# Altium schematic sheet usb ethernet.SchDoc
size A4; SheetNumber: 9; SheetTotal: 9
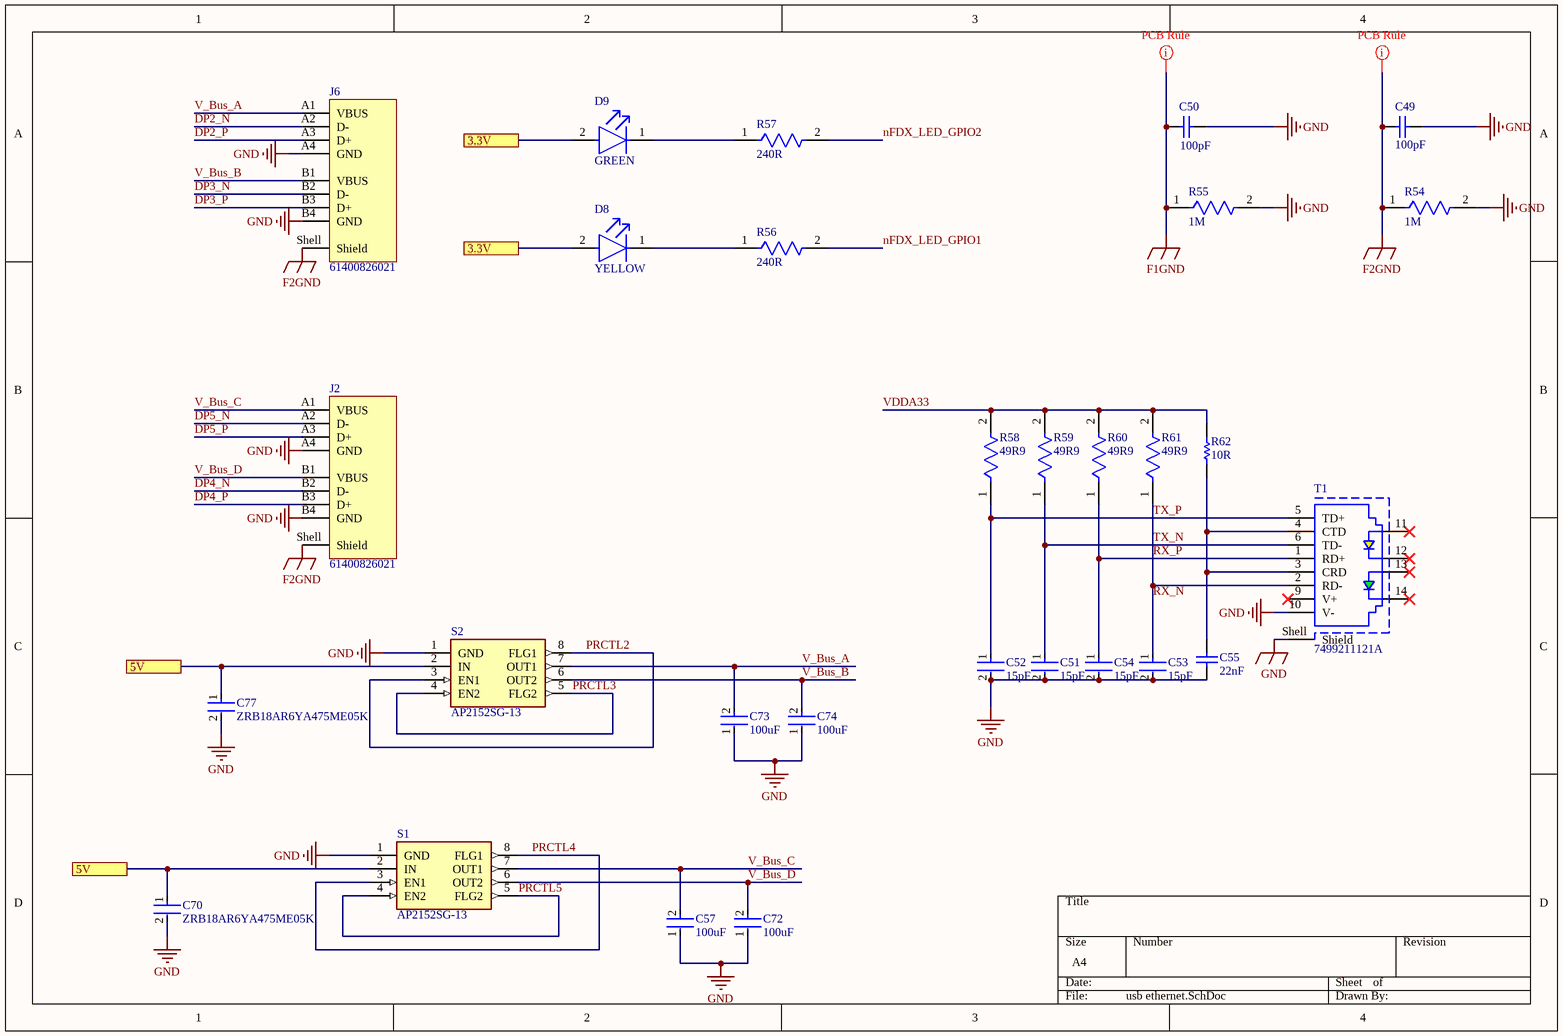
[diagram p0: usb ethernet.SchDoc]

## Parts
C49  100pF  [CAPC1608X95X40LL15T15]
C50  100pF  [CAPC1608X95X40LL15T15]
C51  15pF  [FP-GRM21A-0_2-IPC_C]
C52  15pF  [FP-GRM21A-0_2-IPC_C]
C53  15pF  [FP-GRM21A-0_2-IPC_C]
C54  15pF  [FP-GRM21A-0_2-IPC_C]
C55  22nF  [CAPC2013X94X50ML20T25]
C57  100uF  [FP-GRM31C-0_3-e0_3_0_8-MFG]
C70  ZRB18AR6YA475ME05K  [FP-ZRB18A-0_2-MFG]
C72  100uF  [FP-GRM31C-0_3-e0_3_0_8-MFG]
C73  100uF  [FP-GRM31C-0_3-e0_3_0_8-MFG]
C74  100uF  [FP-GRM31C-0_3-e0_3_0_8-MFG]
C77  ZRB18AR6YA475ME05K  [FP-ZRB18A-0_2-MFG]
D8  YELLOW  [FP-APHCM2012SYCK-F01-MFG]
D9  GREEN  [FP-XZVG53W-1-MFG]
J2  61400826021  [61400826021]
J6  61400826021  [61400826021]
R54  1M  [FP-RMCF0805-MFG]
R55  1M  [FP-RMCF0805-MFG]
R56  240R  [FP-RMCF0201-IPC_C]
R57  240R  [FP-RMCF0201-IPC_C]
R58  49R9  [FP-CPF0603-MFG]
R59  49R9  [FP-CPF0603-MFG]
R60  49R9  [FP-CPF0603-MFG]
R61  49R9  [FP-CPF0603-MFG]
R62  10R  [RESC1005X40X25LL10T10]
S1  AP2152SG-13  [SOIC127P600X175-8N]
S2  AP2152SG-13  [SOIC127P600X175-8N]
T1  7499211121A  [7499211121A]

## Ports
3.3V (see connector1[1B], connector1[1D], connector1[2B], connector1[2D], connector2[1B], connector2[3A], connector2[4A], connector2[4C], connector2[4D], connector2[5C], connector2[6B], connector2[6D], connector2[7B], connector3[1B], connector3[1C], connector3[5C], connector3[5D], connector3[7C], CPLD[2B], CPLD[2C], CPLD[3A], CPLD[4C], ftdi[1B], ftdi[1C], ftdi[1D], ftdi[2B], ftdi[3C], ftdi[4B], usb ethernet[2A]), 5V (see connector1[2C], connector3[8C], usb ethernet[1C]), 5V (see connector1[2C], connector3[8C], usb ethernet[1D])

## Nets
F1GND: C50.1 R55.1
F2GND: C49.1 J2.Shell(Shield) J6.Shell(Shield) R54.1
GND: C49.2 C50.2 C51.2 C52.2 C53.2 C54.2 C55.1 C57.1 C70.2 C72.1 C73.1 C74.1 C77.2 J2.A4(GND) J2.B4(GND) J6.A4(GND) J6.B4(GND) R54.2 R55.2 S1.1(GND) S2.1(GND) T1.10(V-) T1.Shell(Shield)
3.3V: D8.2(A) D9.2(A) ; port 3.3V
5V: C70.1 C77.1 S1.2(IN) S2.2(IN) ; port 5V
DP2_N: J6.A2(D-)
DP2_P: J6.A3(D+)
DP3_N: J6.B2(D-)
DP3_P: J6.B3(D+)
DP4_N: J2.B2(D-)
DP4_P: J2.B3(D+)
DP5_N: J2.A2(D-)
DP5_P: J2.A3(D+)
nFDX_LED_GPIO1: R56.2
nFDX_LED_GPIO2: R57.2
PRCTL2: S2.3(EN1) S2.8(FLG1)
PRCTL3: S2.4(EN2) S2.5(FLG2)
PRCTL4: S1.3(EN1) S1.8(FLG1)
PRCTL5: S1.4(EN2) S1.5(FLG2)
RX_N: C51.1 C52.1 C53.1 C54.1 R58.1 R59.1 R60.1 R61.1 T1.1(RD+) T1.2(RD-) T1.5(TD+) T1.6(TD-)  [also labelled RX_P, TX_N, TX_P]
V_Bus_A: C73.2 J6.A1(VBUS) S2.7(OUT1)
V_Bus_B: C74.2 J6.B1(VBUS) S2.6(OUT2)
V_Bus_C: C57.2 J2.A1(VBUS) S1.7(OUT1)
V_Bus_D: C72.2 J2.B1(VBUS) S1.6(OUT2)
VDDA33: R58.2 R59.2 R60.2 R61.2 R62.2
NetC55_2: C55.2 R62.1 T1.3(CRD) T1.4(CTD)
NetD8_1: D8.1(C) R56.1
NetD9_1: D9.1(C) R57.1

Not connected (* = marked no-connect by the designer): T1 9(V+)* 11* 12* 13* 14*

## Library data of the parts
C49 C50 = CMP-2006-01903-1: Part Number: VJ0603Y101KXQPW1BC; Manufacturer: Vitramon
C51-C54 = CMP-06035-049330-1: Chip Multilayer Ceramic Capacitors for General Purpose, 0805, 15pF, C0G, 30ppm/°C, 1%, 250V
C55 = CMP-2007-04398-1: Part Number: 08055C223KAZ2A; Manufacturer: AVX Interconnect / Elco
C57 C72-C74 = CMP-06035-034850-1: Chip Multilayer Ceramic Capacitors for General Purpose, 1206, 100uF, X5R, 15%, 20%, 6.3V
C70 C77 = CMP-06035-003033-1: Chip Multilayer Ceramic Capacitors 4.7μF ±20% 35Vdc X5R ±15.0% 0603 (1608M)
D8 = CMP-44529-000064-1: LED YELLOW CLEAR CHIP SMD; Number of LEDs: 1; Luminous Intensity: 150mcd; Dominant Wavelength: 590nm; Test Current: 20mA; Illumination Color: Green; Forward Voltage: 2V; Viewing Angle: 110°; Number of Pins: 2; Packaging: Tape and Reel; Width: 1.25mm; Height: 0.4mm; Lens Color: Clear; RoHS Compliant: Yes; Lead Free: Lead Free; Min Operating Temperature: -40°C; Case Code (Imperial): 0805; Case/Package: 0805; Series: APHCM; Wavelength: 590nm; Max Operating Temperature: 85°C; Length: 2mm; Color: Yellow; Package Quantity: 2000; Mount: Surface Mount; Lens Style: Clear; Forward Current: 20mA; Case Code (Metric): 2012
D9 = CMP-92166-000002-1: LED GREEN CLEAR CHIP SMD; Dominant Wavelength: 570nm; Luminous Intensity: 49mcd; Viewing Angle: 120°; Forward Voltage: 2.1V; Lens Color: Colorless; Test Current: 20mA; Case Code (Imperial): 0603; Width: 0.8mm; Length: 1.6mm; Mount: Surface Mount; Case Code (Metric): 1608; Case/Package: 0603; Height: 0.75mm; Series: -; Packaging: Cut Tape; Lens Transparency: Clear; RoHS Compliant: Yes; Color: Green
J2 J6 = CMP-1502-03229-2: NexarPartId: 8917796; Contact Resistance: 20mΩ; Voltage Rating: 30V; Current Rating: 1.5A; Gender: Receptacle; USB Standard: USB 2.0; Insulation Resistance: 1GΩ; Number of Contacts: 8; Number of Ports: 2; Connector Type: USB; Contact Material: Gold; Contact Plating: Gold; Height: 15.7mm; Flammability Rating: UL94 V-0; Voltage Rating (DC): 30V; Insulation Material: PBT; Max Operating Temperature: 105°C; Mount: Horizontal, Through Hole; RoHS: Compliant; Width: 17mm; Orientation: Vertical; Operating Supply Voltage: 30V; REACH SVHC: Unknown; Color: White; Min Operating Temperature: -40°C; Number of Positions: 8; Number of Pins: 8; Length: 15.34mm; Termination: Solder
R54 R55 = CMP-26527-004830-1: 1MΩ ±5% 0.125W 0805 Thick Film Chip Resistor AEC-Q200 compliant; Resistance: 1MR; Temperature Coefficient: 200ppm/°C; Max Power Dissipation: 125mW; Military Standard: Not; Max Operating Temperature: 155°C; Tolerance: 5%; Depth: 1.25mm; Contact Plating: Tin; Min Operating Temperature: -55°C; Case/Package: 0805; Number of Terminations: 2; Height: 0.026inch; Features: Automotive AEC-Q200; Radiation Hardening: No; Series: RMCF; Width: 0.049inch; Packaging: Tape and Reel; Construction: Rectangular; Mount: Surface Mount; Length: 0.079inch; RoHS Compliant: Yes; Resistor Type: Thick Film
R56 R57 = CMP-26527-006303-1: 240Ω ±1% 0.05W 0201 Thick Film Chip Resistor AEC-Q200 compliant; Temperature Coefficient: 200ppm/°C; Max Power Dissipation: 50mW; Tolerance: 1%; Resistor Type: Thick Film; Case Code (Imperial): 0201; Case/Package: 0201; Case Code (Metric): 0603; Min Operating Temperature: -55°C; Length: 0.024inch; Packaging: Tape and Reel; Resistance: 240R; Max Operating Temperature: 125°C; Number of Terminations: 2; Width: 0.012inch; Height: 0.009inch
R58-R61 = CMP-03211-000463-1: RES SMD 49.9Ω 0.1% 1/16W 0603; Manufacturer: TE Connectivity; Manufacturer Part Number: CPF0603B49R9E; Voltage Rating: 50V; Temperature Coefficient: 25ppm/°C; Power Rating: 0.063W; Height: 0.55mm; ComponentLink2URL: https://www.te.com/commerce/DocumentDelivery/DDEController?Action=showdoc&DocId=Data+Sheet%7F1773200%7FM%7Fpdf%7FEnglish%7FENG_DS_1773200_M.pdf%7F3-1676481-2; Ipc Land Pattern Name: RESC15580X45; Category: Res; Tolerance: 0.1%; Temperature Range High: +155°C; Device Class L1: Passive Components; Composition: Thin Film; Package: CPF0603; Automotive: No; Temperature: -55°C to +155°C; Octopart: https://octopart.com/cpf0603b49r9e-te+connectivity-80329779; ComponentLink2Description: Datasheet; Device Class L3: Chip SMD Resistors; Value: 49.9Ω; octopart_url: https://octopart.com/cpf0603b49r9e-te+connectivity-80329779; Device Class L2: Resistors; Lead Free: Yes; Temperature Range Low: -55°C; Series: CPF; RoHS: TRUE; packaging: 5k Reel; Resistance: 49.9Ω
R62 = CMP-2002-04164-1: Part Number: SG73P1ETTP10R0F; Manufacturer: KOA Speer
S1 S2 = AP2152SG-13: Switch; Manufacturer_Name: Diodes Incorporated; Datasheet Link: https://www.diodes.com//assets/Datasheets/AP2142_52.pdf; Height: 1.75mm; Manufacturer_Part_Number: AP2152SG-13; Mouser Part Number: 621-AP2152SG-13; Mouser Price/Stock: https://www.mouser.co.uk/ProductDetail/Diodes-Incorporated/AP2152SG-13?qs=ptj1V1atRAqb3D%2FsyOSpHA%3D%3D; Arrow Part Number: AP2152SG-13; Arrow Price/Stock: https://www.arrow.com/en/products/ap2152sg-13/diodes-incorporated
T1 = CMP-03913-22662229-2: 7499211121A Modular Connectors / Ethernet Connectors WE-RJ45 Int XFMR THT 1x1; Number of Contacts: 8; Color: Green, Silver, Yellow; Inductance: 350µH; Number of Ports: 1; Number of Cores per Jack: 6; Insertion Loss (dB): -1.7dB; Direction: Down; Connector Type: RJ45, Socket; Pitch: 2.54mm; Gender: Female; Shielding: Shielded; Lead Free: Lead Free; Depth: 21.84mm; RoHS: Compliant; Number of Positions: 8; Max Operating Temperature: 85°C; Height: 14mm; Termination: Through Hole; NexarPartId: 22662229; Case/Package: Metal; Orientation: Right Angle; Width: 16mm; Number of Rows: 1; Housing Material: Thermoplastic; REACH SVHC: Unknown; Min Operating Temperature: -40°C; Contact Material: Ferrite, Gold; Length: 22mm; Mount: Through Hole; Flammability Rating: UL94 V-0; Contact Plating: Gold